# Altium project PROC101D_SCH_With_Design_Updates..Notes_V1.0.PrjPcb (part 9 of 23)

## Sheet 22.SchDoc
size 513 x 386 mm
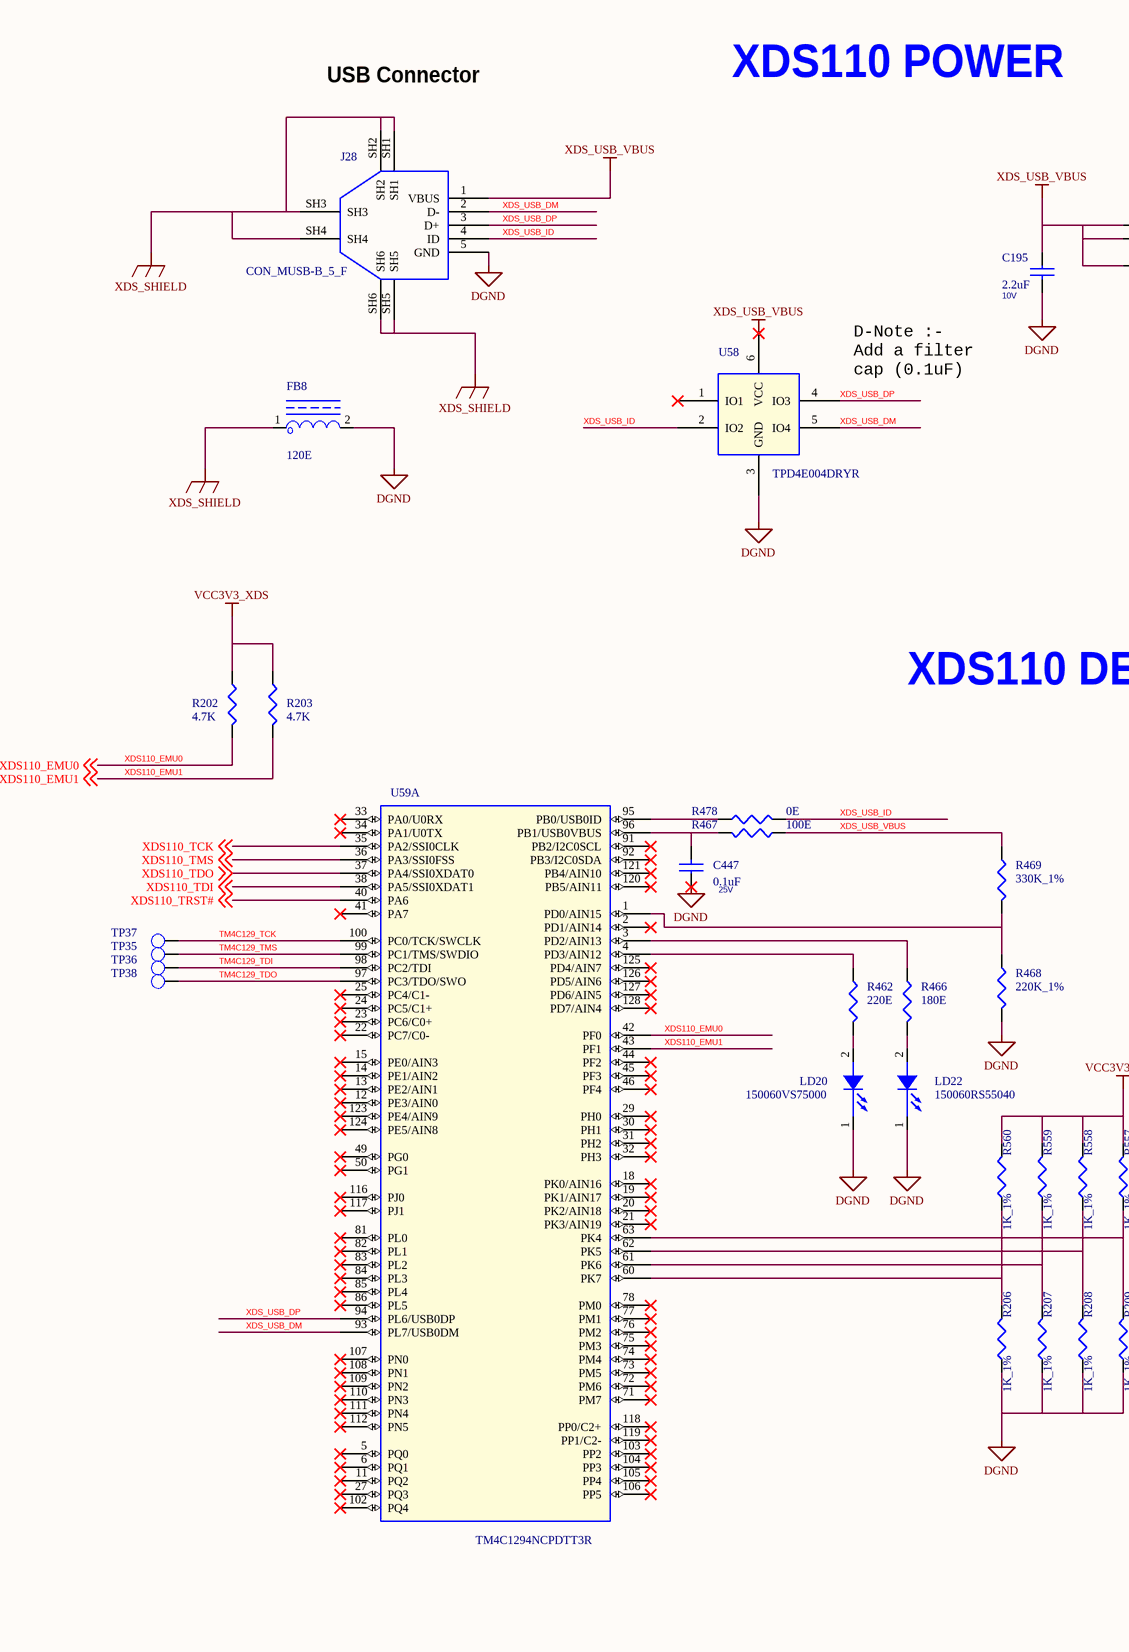
[diagram p34: 22.SchDoc, left]
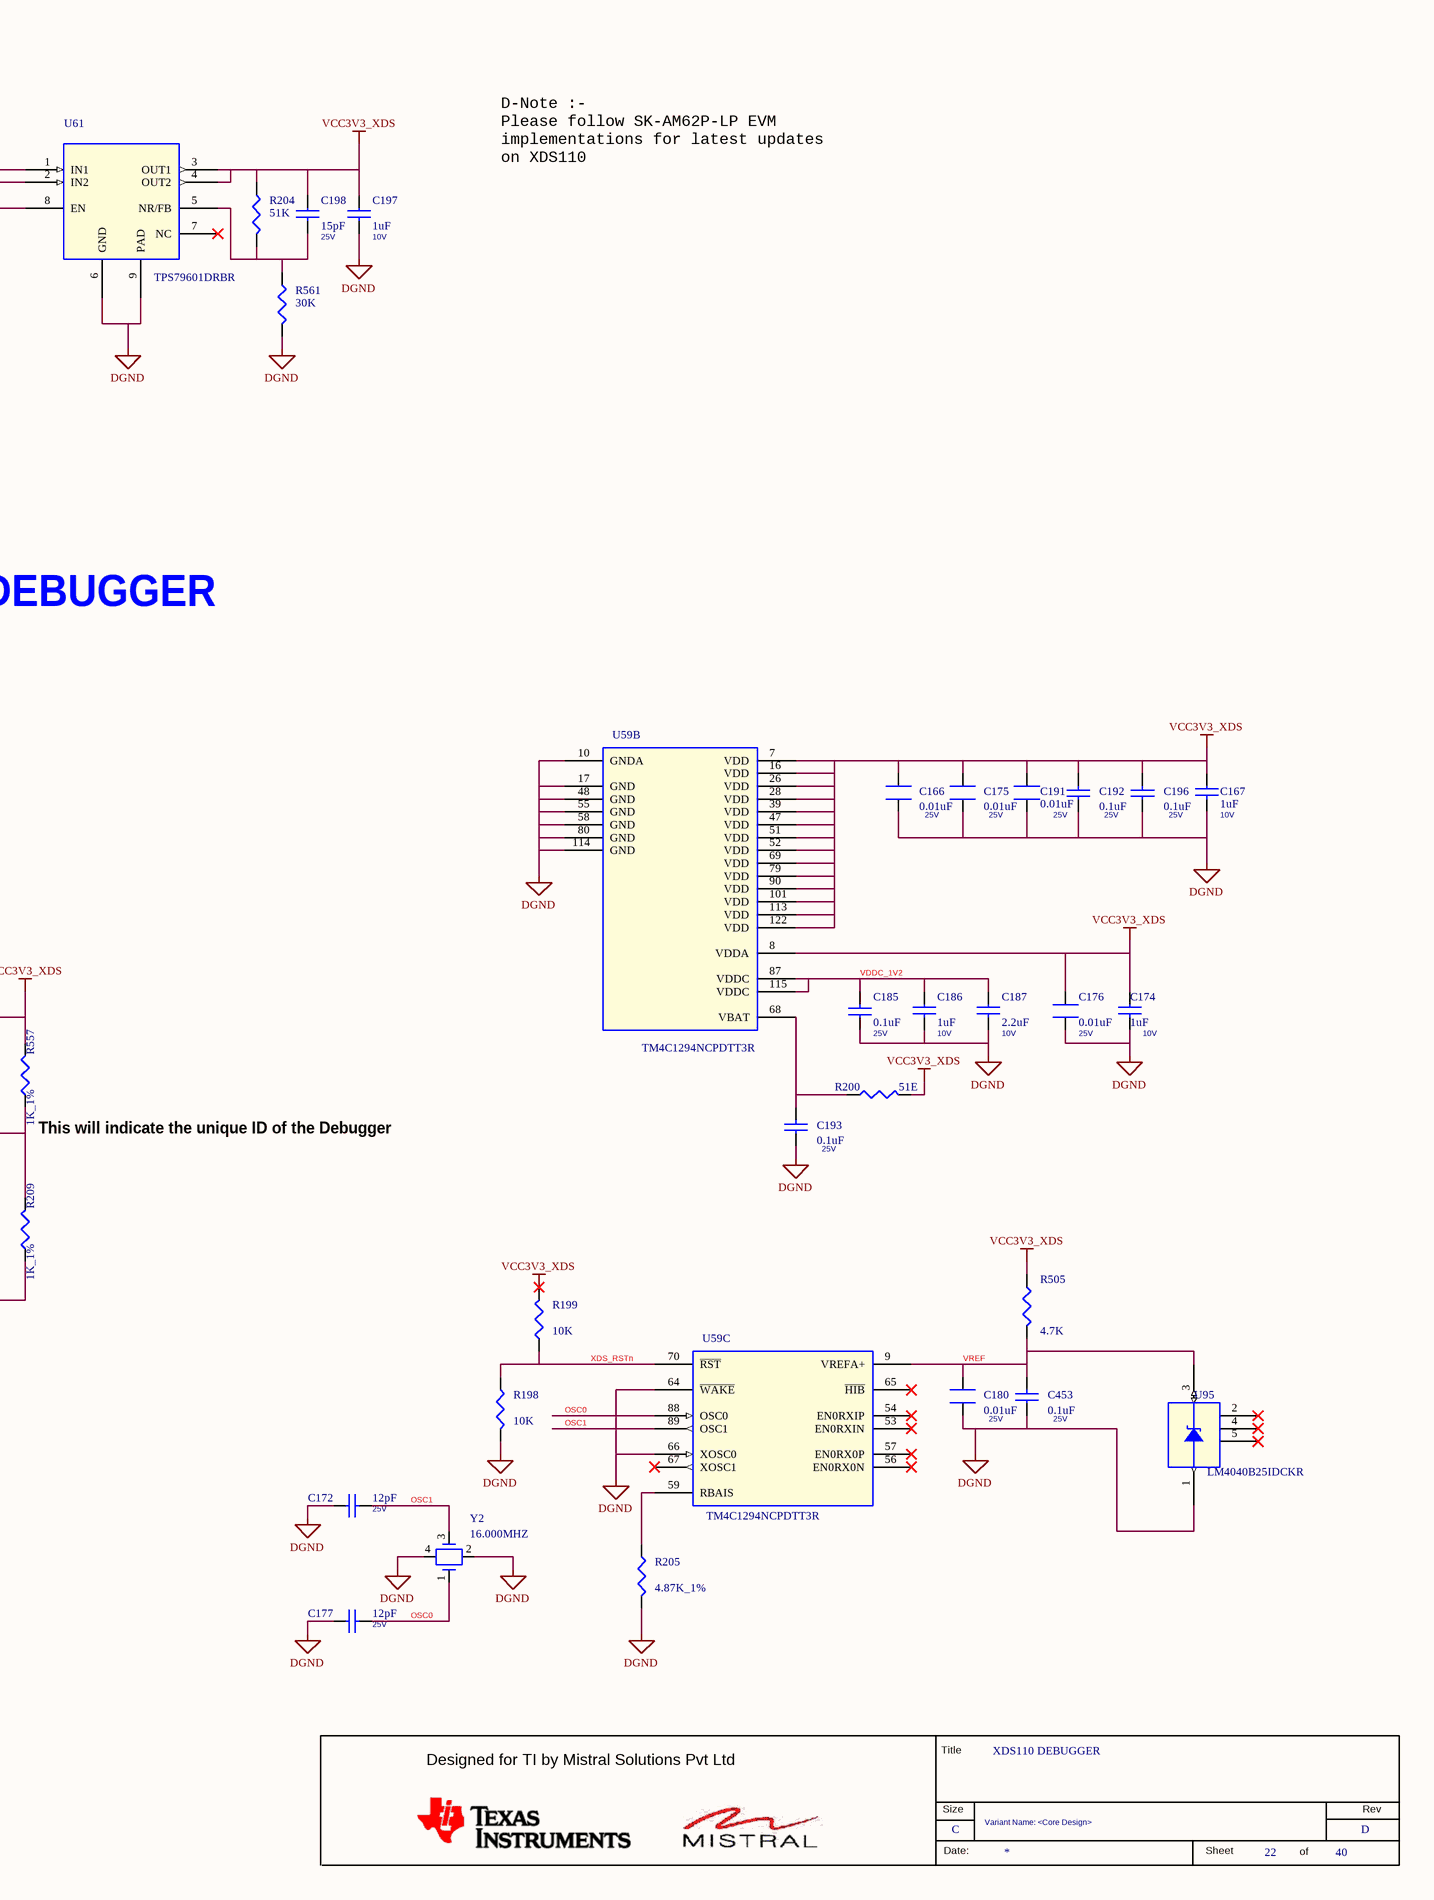
[diagram p35: 22.SchDoc, right]

### Parts
(Parts that share a designator on the sheet are numbered #1, #2 ... from top to bottom, then left to right.)
*#22  RevCode: D  Title: XDS110 DEBUGGER  Page Size: C  Page Number: 22  Page Count: 40  Variant Name: <Core Design>  (hidden comment: MISTRAL_TITLEBLK_CSIZE)  (graphical)
C166  0.01uF  Voltage: 25V  [CAP0402N]
C167  1uF  Voltage: 10V  [CAP0402_0-75]
C172  12pF  Voltage: 25V  [CAP0201_0-5]
C174  1uF  Voltage: 10V  [CAP0402_0-75]
C175  0.01uF  Voltage: 25V  [CAP0402N]
C176  0.01uF  Voltage: 25V  [CAP0402N]
C177  12pF  Voltage: 25V  [CAP0201_0-5]
C180  0.01uF  Voltage: 25V  [CAP0402N]
C185  0.1uF  Voltage: 25V  [CAP0402_0-75]
C186  1uF  Voltage: 10V  [CAP0402_0-75]
C187  2.2uF  Voltage: 10V  [CAP0402_0-75]
C191  0.01uF  Voltage: 25V  [CAP0402N]
C192  0.1uF  Voltage: 25V  [CAP0402_0-75]
C193  0.1uF  Voltage: 25V  [CAP0402_0-75]
C195  2.2uF  Voltage: 10V  [CAP0402_0-75]
C196  0.1uF  Voltage: 25V  [CAP0402_0-75]
C197  1uF  Voltage: 10V  [CAP0402_0-75]
C198  15pF  Voltage: 25V  [CAP0402_0-75]
C447  0.1uF  Voltage: 25V  [CAP0402_0-75]
C453  0.1uF  Voltage: 25V  [CAP0402_0-75]
FB8  120E  [IND0603_1]
J28  CON_MUSB-B_5_F  [CON_MUSBB5_1051640001_S_R_S_2-5]
LD20  150060VS75000  [LED_150060SS75000_70X40_SMD_0-8]
LD22  150060RS55040  [LED_150060RS55040_70X40_SMD_0-5]
R198  10K  [RES0402_0-5]
R199  10K  [RES0402_0-5]
R200  51E  [RES0402_0-5]
R202  4.7K  [RES0402_0-5]
R203  4.7K  [RES0402_0-5]
R204  51K  [RES0402_0-5]
R205  4.87K_1%  [RES0402_0-5]
R206  1K_1%  [RES0402_0-5]
R207  1K_1%  [RES0402_0-5]
R208  1K_1%  [RES0402_0-5]
R209  1K_1%  [RES0402_0-5]
R462  220E  [RES0402_0-5]
R466  180E  [RES0402_0-5]
R467  100E  [RES0402_0-5]
R468  220K_1%  [RES0402_0-5]
R469  330K_1%  [RES0402_0-5]
R478  0E  [RES0402_0-5]
R505  4.7K  [RES0402_0-5]
R557  1K_1%  [RES0402_0-5]
R558  1K_1%  [RES0402_0-5]
R559  1K_1%  [RES0402_0-5]
R560  1K_1%  [RES0402_0-5]
R561  30K  [RES0402_0-5]
TP35  TP20_SMD  [TP20_SMD]  (value not drawn)
TP36  TP20_SMD  [TP20_SMD]  (value not drawn)
TP37  TP20_SMD  [TP20_SMD]  (value not drawn)
TP38  TP20_SMD  [TP20_SMD]  (value not drawn)
U58  TPD4E004DRYR  [SON6_19-68_40X60_PB_0-6]
U59  TM4C1294NCPDTT3R  [TQFP128_15-74_550X550_1-2]  (parts A,B,C of 3)
U61  TPS79601DRBR  [SON8_25-59_130X130_1]
U95  LM4040B25IDCKR  [SC70-5_1-1]
Y2  16.000MHZ  [XTAL4_NX3225GA_130X100_SMD_0-9]

### Nets
DGND: C166.2 C167.2 C172.1 C174.2 C175.2 C176.2 C177.1 C180.2 C185.1 C186.2 C187.2 C191.2 C192.1 C193.1 C195.2 C196.1 C197.2 C447.1 C453.1 FB8.2 J28.5(GND) LD20.1(CATHODE) LD22.1(CATHODE) R198.2 R205.2 R206.1 R207.1 R208.1 R209.1 R468.2 R561.2 U58.3(GND) U59.10(GNDA) U59.17(GND) U59.48(GND) U59.55(GND) U59.58(GND) U59.64(~{WAKE}) U59.66(XOSC0) U59.80(GND) U59.114(GND) U61.6(GND) U61.9(PAD) U95.1(ANODE) Y2.2 Y2.4
VCC3V3_XDS: C166.1 C167.1 C174.1 C175.1 C176.1 C191.1 C192.2 C196.2 C197.1 C198.1 R199.2 R200.2 R202.1 R203.1 R204.1 R505.1 R557.2 R558.2 R559.2 R560.2 U59.7(VDD) U59.8(VDDA) U59.16(VDD) U59.26(VDD) U59.28(VDD) U59.39(VDD) U59.47(VDD) U59.51(VDD) U59.52(VDD) U59.69(VDD) U59.79(VDD) U59.90(VDD) U59.101(VDD) U59.113(VDD) U59.122(VDD) U61.3(OUT1) U61.4(OUT2)
XDS_SHIELD: FB8.1 J28.SH1 J28.SH2 J28.SH3 J28.SH4 J28.SH5 J28.SH6
XDS_USB_VBUS: C195.1 J28.1(VBUS) R467.1 R469.1 U58.6(VCC) U61.1(IN1) U61.2(IN2) U61.8(EN)
OSC0: C177.2 U59.88(OSC0) Y2.1
OSC1: C172.2 U59.89(OSC1) Y2.3
TM4C129_TCK: TP37.1(TP) U59.100(PC0/TCK/SWCLK)
TM4C129_TDI: TP36.1(TP) U59.98(PC2/TDI)
TM4C129_TDO: TP38.1(TP) U59.97(PC3/TDO/SWO)
TM4C129_TMS: TP35.1(TP) U59.99(PC1/TMS/SWDIO)
VDDC_1V2: C185.2 C186.1 C187.1 U59.87(VDDC) U59.115(VDDC)
VREF: C180.1 C453.2 R505.2 U59.9(VREFA+) U95.3(CATHODE)
XDS110_EMU0: R202.2 U59.42(PF0) ; off-sheet XDS110_EMU0
XDS110_EMU1: R203.2 U59.43(PF1) ; off-sheet XDS110_EMU1
XDS110_TCK: U59.35(PA2/SSI0CLK) ; off-sheet XDS110_TCK
XDS110_TDI: U59.38(PA5/SSI0XDAT1) ; off-sheet XDS110_TDI
XDS110_TDO: U59.37(PA4/SSI0XDAT0) ; off-sheet XDS110_TDO
XDS110_TMS: U59.36(PA3/SSI0FSS) ; off-sheet XDS110_TMS
XDS110_TRST#: U59.40(PA6) ; off-sheet XDS110_TRST#
XDS_RSTn: R198.1 R199.1 U59.70(~{RST})
XDS_USB_DM: J28.2(D-) U58.5(IO4) U59.93(PL7/USB0DM)
XDS_USB_DP: J28.3(D+) U58.4(IO3) U59.94(PL6/USB0DP)
XDS_USB_ID: J28.4(ID) R478.2 U58.2(IO2)
NetC193_2: C193.2 R200.1 U59.68(VBAT)
NetC198_2: C198.2 R204.2 R561.1 U61.5(NR/FB)
NetC447_2: C447.2 R467.2 U59.96(PB1/USB0VBUS)
NetLD20_2: LD20.2(ANODE) R462.2
NetLD22_2: LD22.2(ANODE) R466.2
NetR205_1: R205.1 U59.59(RBAIS)
NetR206_2: R206.2 R560.1 U59.60(PK7)
NetR207_2: R207.2 R559.1 U59.61(PK6)
NetR208_2: R208.2 R558.1 U59.62(PK5)
NetR209_2: R209.2 R557.1 U59.63(PK4)
NetR462_1: R462.1 U59.4(PD3/AIN12)
NetR466_1: R466.1 U59.3(PD2/AIN13)
NetR468_1: R468.1 R469.2 U59.1(PD0/AIN15)
NetR478_1: R478.1 U59.95(PB0/USB0ID)

Not connected (* = marked no-connect by the designer): U58 1(IO1)*; U59 2(PD1/AIN14)* 5(PQ0)* 6(PQ1)* 11(PQ2)* 12(PE3/AIN0)* 13(PE2/AIN1)* 14(PE1/AIN2)* 15(PE0/AIN3)* 18(PK0/AIN16)* 19(PK1/AIN17)* 20(PK2/AIN18)* 21(PK3/AIN19)* 22(PC7/C0-)* 23(PC6/C0+)* 24(PC5/C1+)* 25(PC4/C1-)* 27(PQ3)* 29(PH0)* 30(PH1)* 31(PH2)* 32(PH3)* 33(PA0/U0RX)* 34(PA1/U0TX)* 41(PA7)* 44(PF2)* 45(PF3)* 46(PF4)* 49(PG0)* 50(PG1)* 53(EN0RXIN)* 54(EN0RXIP)* 56(EN0RX0N)* 57(EN0RX0P)* 65(~{HIB})* 67(XOSC1)* 71(PM7)* 72(PM6)* 73(PM5)* 74(PM4)* 75(PM3)* 76(PM2)* 77(PM1)* 78(PM0)* 81(PL0)* 82(PL1)* 83(PL2)* 84(PL3)* 85(PL4)* 86(PL5)* 91(PB2/I2C0SCL)* 92(PB3/I2C0SDA)* 102(PQ4)* 103(PP2)* 104(PP3)* 105(PP4)* 106(PP5)* 107(PN0)* 108(PN1)* 109(PN2)* 110(PN3)* 111(PN4)* 112(PN5)* 116(PJ0)* 117(PJ1)* 118(PP0/C2+)* 119(PP1/C2-)* 120(PB5/AIN11)* 121(PB4/AIN10)* 123(PE4/AIN9)* 124(PE5/AIN8)* 125(PD4/AIN7)* 126(PD5/AIN6)* 127(PD6/AIN5)* 128(PD7/AIN4)*; U61 7(NC)*; U95 2(NC1)* 4(NC2)* 5(NC3)*

### Notes on the sheet
- USB Connector
- XDS110 POWER
- D-Note :-
  Please follow SK-AM62P-LP EVM
  implementations for latest updates
  on XDS110
- D-Note :-
  Add a filter
  cap (0.1uF)
- XDS110 DEBUGGER
- (near R557) This will indicate the unique ID of the Debugger
- (in symbol MISTRAL_TITLEBLK_CSIZE) Title; Designed for TI by Mistral Solutions Pvt Ltd; Size; Rev; Date:; Sheet; of

### Library data of the parts
*#22 = MISTRAL_TITLEBLK_CSIZE: Issue: 1.0; Page Create Date: March  8, 1995; Page Modify Date: *
C166 C175 C180 C191 = CAP_Dup2: CAP CERAMIC 0.01uF 25V 10% X7R 0402; Mistral Part No: 120011090040-R; Mfr_name: WURTH ELECTRONICS; Mfr_part_number: 885012205050; Part_type: CAPACITORS\CERAMIC; PCB Footprint: CAP0402_0-75; Project: AM64x_EVM_BRD; Customs_HS_Code: 85322990; Custom_Duty: 15%; Wattage: NA; Library Ref: CAP; Tolerance: 10%; Package: 0402; Distributor_name: DIGIKEY; Distributor_part_number: 732-7545-1-ND; Height: 0.55MM; Datasheet: Y:\MIS_DATABASE\DATASHEETS\CAPACITORS\885012205050.PDF; Crtd /date: ALVY/170820; Chkd/date: MANIRAJA/170820; Weight: 0.65mg; Temperature: -55癈+125癈; MECHANICAL 3D STEP FILE: CAP0402_0-75; Footprint Ref: CAP0402_0-75; Library Path: Y:\MIS_DATABASE\Library\ALTIUM_TOOL\SCHEMATICS_PARTS\MS_DISCRETE_Library.schlib; Footprint Path: Y:\MIS_DATABASE\Library\ALTIUM_TOOL\PCB_FOOTPRINTS\Altium_Footprint_Lib.PcbLib
C167 C174 = CAP_Dup3: CAP CERAMIC 1uF 10V 20% X5R 0402; Part_type: CAPACITORS\CERAMIC; Mfr_part_number: 885012105012; Mfr_name: WURTH ELECTRONICS; Mistral Part No: 120020080009-R; Wattage: NA; Custom_Duty: 15%; Customs_HS_Code: 85322990; Project: AM64x_EVM_BRD; PCB Footprint: CAP0402_0-75; Footprint Ref: CAP0402_0-75; Library Ref: CAP; Footprint Path: Y:\MIS_DATABASE\Library\ALTIUM_TOOL\PCB_FOOTPRINTS\Altium_Footprint_Lib.PcbLib; Library Path: Y:\MIS_DATABASE\Library\ALTIUM_TOOL\SCHEMATICS_PARTS\MS_DISCRETE_Library.schlib; MECHANICAL 3D STEP FILE: CAP0402_0-75; Chkd/date: MANIRAJA/210820; Crtd /date: ALVY/190820; Datasheet: Y:\MIS_DATABASE\DATASHEETS\CAPACITORS\885012105012.PDF; Temperature: -55癈+85癈; Weight: 0.65mg; Height: 0.55MM; Distributor_part_number: 732-7489-1-ND; Distributor_name: DIGIKEY; Package: 0402; Tolerance: 20%
C172 = CAP_Dup3: CAP CERAMIC 12pF 25V 5% C0G(NP0) 0201; Part_type: CAPACITORS\CERAMIC; Mfr_part_number: GRM0335C1E120JA01D; Mfr_name: MURATA; Mistral Part No: 120009030213-R; Custom_Duty: 15%; Customs_HS_Code: 85322990; Wattage: NA; Project: QCS610_NANOSOM; PCB Footprint: CAP0201_0-5; Footprint Path: Y:\MIS_DATABASE\Library\ALTIUM_TOOL\PCB_FOOTPRINTS\Altium_Footprint_Lib.PcbLib; Library Path: Y:\MIS_DATABASE\Library\ALTIUM_TOOL\SCHEMATICS_PARTS\MS_DISCRETE_Library.schlib; MECHANICAL 3D STEP FILE: CAP0201_0-5; Chkd/date: MANIRAJA/020620; Crtd /date: ALVY/300520; Datasheet: Y:\MIS_DATABASE\DATASHEETS\CAPACITORS\GRM0335C1E120JA01.PDF; Temperature: -55癈+125癈; Weight: 0.33mg; Height: 0.33MM; Library Ref: CAP; Distributor_part_number: 490-3144-1-ND; Distributor_name: DIGIKEY; Package: 0201; Tolerance: 5%; Footprint Ref: CAP0201_0-5
C176 = CAP_Dup2: CAP CERAMIC 0.01uF 25V 10% X7R 0402; Part_type: CAPACITORS\CERAMIC; Mfr_part_number: 885012205050; Mfr_name: WURTH ELECTRONICS; Mistral Part No: 120011090040-R; PCB Footprint: CAP0402_0-75; Wattage: NA; Custom_Duty: 15%; Customs_HS_Code: 85322990; Project: AM64x_EVM_BRD; Footprint Path: Y:\MIS_DATABASE\Library\ALTIUM_TOOL\PCB_FOOTPRINTS\Altium_Footprint_Lib.PcbLib; Library Path: Y:\MIS_DATABASE\Library\ALTIUM_TOOL\SCHEMATICS_PARTS\MS_DISCRETE_Library.schlib; Footprint Ref: CAP0402_0-75; MECHANICAL 3D STEP FILE: CAP0402_0-75; Temperature: -55癈+125癈; Weight: 0.65mg; Chkd/date: MANIRAJA/170820; Crtd /date: ALVY/170820; Datasheet: Y:\MIS_DATABASE\DATASHEETS\CAPACITORS\885012205050.PDF; Height: 0.55MM; Distributor_part_number: 732-7545-1-ND; Distributor_name: DIGIKEY; Package: 0402; Tolerance: 10%; Library Ref: CAP
C177 = CAP_Dup3: CAP CERAMIC 12pF 25V 5% C0G(NP0) 0201; Mistral Part No: 120009030213-R; Mfr_name: MURATA; Mfr_part_number: GRM0335C1E120JA01D; Part_type: CAPACITORS\CERAMIC; Project: QCS610_NANOSOM; Wattage: NA; Customs_HS_Code: 85322990; Custom_Duty: 15%; PCB Footprint: CAP0201_0-5; Footprint Ref: CAP0201_0-5; Tolerance: 5%; Package: 0201; Distributor_name: DIGIKEY; Distributor_part_number: 490-3144-1-ND; Library Ref: CAP; Height: 0.33MM; Weight: 0.33mg; Temperature: -55癈+125癈; Datasheet: Y:\MIS_DATABASE\DATASHEETS\CAPACITORS\GRM0335C1E120JA01.PDF; Crtd /date: ALVY/300520; Chkd/date: MANIRAJA/020620; MECHANICAL 3D STEP FILE: CAP0201_0-5; Library Path: Y:\MIS_DATABASE\Library\ALTIUM_TOOL\SCHEMATICS_PARTS\MS_DISCRETE_Library.schlib; Footprint Path: Y:\MIS_DATABASE\Library\ALTIUM_TOOL\PCB_FOOTPRINTS\Altium_Footprint_Lib.PcbLib
C185 C196 = CAP_Dup3: CAP CERAMIC 0.1uF 25V 20% X5R 0402; Alt_Mfr_part_number: CC0402KRX5R8BB104; Mistral Part No: 120020080003-R; Mfr_name: WURTH ELECTRONICS; Mfr_part_number: 885012105018; Part_type: CAPACITORS\CERAMIC; Alt_Mfr_name: YAGEO AMERICA; Project: AM64x_EVM_BRD; Wattage: NA; Customs_HS_Code: 85322990; Custom_Duty: 15%; PCB Footprint: CAP0402_0-75; Tolerance: 20%; Package: 0402; Distributor_name: DIGIKEY; Distributor_part_number: 732-7495-1-ND; Height: 0.55MM; Weight: 0.65mg; Temperature: -55癈+85癈; Datasheet: Y:\MIS_DATABASE\DATASHEETS\CAPACITORS\885012105018.PDF; Crtd /date: ALVY/170820; Chkd/date: MANIRAJA/170820; MECHANICAL 3D STEP FILE: CAP0402_0-75; Library Ref: CAP; Footprint Ref: CAP0402_0-75; Library Path: Y:\MIS_DATABASE\Library\ALTIUM_TOOL\SCHEMATICS_PARTS\MS_DISCRETE_Library.schlib; Footprint Path: Y:\MIS_DATABASE\Library\ALTIUM_TOOL\PCB_FOOTPRINTS\Altium_Footprint_Lib.PcbLib
C186 C197 = CAP_Dup3: CAP CERAMIC 1uF 10V 20% X5R 0402; Mistral Part No: 120020080009-R; Mfr_name: WURTH ELECTRONICS; Mfr_part_number: 885012105012; Part_type: CAPACITORS\CERAMIC; Wattage: NA; Project: AM64x_EVM_BRD; Customs_HS_Code: 85322990; Custom_Duty: 15%; PCB Footprint: CAP0402_0-75; Footprint Ref: CAP0402_0-75; Library Ref: CAP; Footprint Path: Y:\MIS_DATABASE\Library\ALTIUM_TOOL\PCB_FOOTPRINTS\Altium_Footprint_Lib.PcbLib; Library Path: Y:\MIS_DATABASE\Library\ALTIUM_TOOL\SCHEMATICS_PARTS\MS_DISCRETE_Library.schlib; MECHANICAL 3D STEP FILE: CAP0402_0-75; Tolerance: 20%; Package: 0402; Distributor_name: DIGIKEY; Distributor_part_number: 732-7489-1-ND; Height: 0.55MM; Weight: 0.65mg; Temperature: -55癈+85癈; Datasheet: Y:\MIS_DATABASE\DATASHEETS\CAPACITORS\885012105012.PDF; Crtd /date: ALVY/190820; Chkd/date: MANIRAJA/210820
C187 C195 = CAP_Dup3: CAP CERAMIC 2.2uF 10V 20% X5R 0402; Part_type: CAPACITORS\CERAMIC; Mfr_part_number: 885012105013; Mfr_name: WURTH ELECTRONICS; Mistral Part No: 120019040036-R; Custom_Duty: 15%; Customs_HS_Code: 85322990; Wattage: NA; Project: AM64x_EVM_BRD; PCB Footprint: CAP0402_0-75; Library Ref: CAP; MECHANICAL 3D STEP FILE: CAP0402_0-75; Chkd/date: MANIRAJA/170820; Crtd /date: ALVY/170820; Datasheet: Y:\MIS_DATABASE\DATASHEETS\CAPACITORS\885012105013.PDF; Temperature: -55癈+85癈; Weight: 0.65mg; Height: 0.55MM; Distributor_part_number: 732-7490-1-ND; Distributor_name: DIGIKEY; Package: 0402; Tolerance: 20%; Footprint Ref: CAP0402_0-75; Library Path: Y:\MIS_DATABASE\Library\ALTIUM_TOOL\SCHEMATICS_PARTS\MS_DISCRETE_Library.schlib; Footprint Path: Y:\MIS_DATABASE\Library\ALTIUM_TOOL\PCB_FOOTPRINTS\Altium_Footprint_Lib.PcbLib
C192 C193 C447 C453 = CAP_Dup3: CAP CERAMIC 0.1uF 25V 20% X5R 0402; Alt_Mfr_name: YAGEO AMERICA; Part_type: CAPACITORS\CERAMIC; Mfr_part_number: 885012105018; Mfr_name: WURTH ELECTRONICS; Mistral Part No: 120020080003-R; Alt_Mfr_part_number: CC0402KRX5R8BB104; Custom_Duty: 15%; Customs_HS_Code: 85322990; Wattage: NA; Project: AM64x_EVM_BRD; PCB Footprint: CAP0402_0-75; Footprint Path: Y:\MIS_DATABASE\Library\ALTIUM_TOOL\PCB_FOOTPRINTS\Altium_Footprint_Lib.PcbLib; Library Path: Y:\MIS_DATABASE\Library\ALTIUM_TOOL\SCHEMATICS_PARTS\MS_DISCRETE_Library.schlib; Footprint Ref: CAP0402_0-75; Library Ref: CAP; MECHANICAL 3D STEP FILE: CAP0402_0-75; Chkd/date: MANIRAJA/170820; Crtd /date: ALVY/170820; Datasheet: Y:\MIS_DATABASE\DATASHEETS\CAPACITORS\885012105018.PDF; Temperature: -55癈+85癈; Weight: 0.65mg; Height: 0.55MM; Distributor_part_number: 732-7495-1-ND; Distributor_name: DIGIKEY; Package: 0402; Tolerance: 20%
C198 = CAP_Dup3: CAP CERAMIC 15pF 25V 5% C0G(NP0) 0402; Part_type: CAPACITORS\CERAMIC; Mfr_part_number: 885012005041; Mfr_name: WURTH ELECTRONICS; Mistral Part No: 120020020004-R; Custom_Duty: 15%; Customs_HS_Code: 85322990; Wattage: NA; Project: AM64x_EVM_BRD; PCB Footprint: CAP0402_0-75; Library Ref: CAP; MECHANICAL 3D STEP FILE: CAP0402_0-75; Chkd/date: MANIRAJA/170820; Crtd /date: ALVY/170820; Datasheet: Y:\MIS_DATABASE\DATASHEETS\CAPACITORS\885012005041.PDF; Temperature: -55癈+125癈; Weight: 0.65mg; Height: 0.55MM; Distributor_part_number: 732-7456-1-ND; Distributor_name: DIGIKEY; Package: 0402; Tolerance: 5%; Footprint Ref: CAP0402_0-75; Library Path: Y:\MIS_DATABASE\Library\ALTIUM_TOOL\SCHEMATICS_PARTS\MS_DISCRETE_Library.schlib; Footprint Path: Y:\MIS_DATABASE\Library\ALTIUM_TOOL\PCB_FOOTPRINTS\Altium_Footprint_Lib.PcbLib
FB8 = INDUCTOR_FERRITE: IND FERRITE BEAD CHIP 120E 2A 0603; Mfr_part_number: 782631141; Mfr_name: WURTH ELECTRONICS; Mistral Part No: 130020080015-R; Custom_Duty: 24%; Customs_HS_Code: 85437099; Wattage: NA; Tolerance: 25%; Project: AM64x_EVM_BRD; Footprint Path: Y:\MIS_DATABASE\Library\ALTIUM_TOOL\PCB_FOOTPRINTS\Altium_Footprint_Lib.PcbLib; Library Path: Y:\MIS_DATABASE\Library\ALTIUM_TOOL\SCHEMATICS_PARTS\MS_FILTER_Library.schlib; MECHANICAL 3D STEP FILE: IND0603_1; Chkd/date: MANIRAJA/180820; Crtd /date: ALVY/180820; Datasheet: Y:\MIS_DATABASE\DATASHEETS\DISCRETES\INDUCTORS\782631141.PDF; Temperature: -55癈+125癈; Weight: NA; Height: 1.00MM; Library Ref: INDUCTOR_FERRITE; Distributor_part_number: 732-782631141CT-ND; Distributor_name: DIGIKEY; Package: 0603; Voltage: NA; Part_type: INDUCTOR; Footprint Ref: IND0603_1; PCB Footprint: IND0603_1
J28 = CON_MUSB-B_5_1051640001: CON MICRO USB-B TYPE 5POS FEMALE RT SMD; Part_type: CONNECTOR\USB; Mfr_name: MOLEX; Mistral Part No: 150017080018-R; Custom_Duty: 24%; Customs_HS_Code: 85369090; Wattage: NA; Project: TI_MAXIE_CPB; Library Ref: CON_MUSB-B_5_1051640001; MECHANICAL 3D STEP FILE: CON_MUSBB5_1051640001_S_R_S_2-5; Chkd/date: MANIRAJA/230817; Crtd /date: MANIRAJA/230817; Datasheet: Y:\MIS_DATABASE\DATASHEETS\CONNECTORS\1051640001.PDF; Temperature: -35癈+85癈; Weight: 234mg; Height: 2.45MM; Distributor_part_number: WM11263CT-ND; Distributor_name: DIGIKEY; Package: SMD; Voltage: NA; Tolerance: NA; Mfr_part_number: 1051640001; PCB Footprint: CON_MUSBB5_1051640001_S_R_S_2-5
LD20 = DIODE_LED: DIODE LED BRIGHT GREEN SMD; Part_type: OPTO\LED; Mfr_name: WURTH ELECTRONICS; Mistral Part No: 130020070019-R; Custom_Duty: 24%; Customs_HS_Code: 85439000; Wattage: NA; Project: AM64x-IO LINK BRD; Footprint Path: Y:\MIS_DATABASE\Library\ALTIUM_TOOL\PCB_FOOTPRINTS\Altium_Footprint_Lib.PcbLib; Library Path: Y:\MIS_DATABASE\Library\ALTIUM_TOOL\SCHEMATICS_PARTS\MS_OPTO_Library.schlib; MECHANICAL 3D STEP FILE: LED_150060SS75000_70X40_SMD_0-8; Footprint Ref: LED_150060SS75000_70X40_SMD_0-8; Library Ref: DIODE_LED; Chkd/date: MANIRAJA/220720; Crtd /date: ALVY/210720; Datasheet: Y:\MIS_DATABASE\DATASHEETS\DISCRETES\LEDS\150060VS75000.PDF; Temperature: -40癈+85癈; Weight: 25mg; Height: 0.80MM; Distributor_part_number: 732-4980-1-ND; Distributor_name: DIGIKEY; Package: SMD; Voltage: NA; Tolerance: NA; Mfr_part_number: 150060VS75000; PCB Footprint: LED_150060SS75000_70X40_SMD_0-8
LD22 = DIODE_LED: DIODE LED RED SMD; Mistral Part No: 130020080014-R; Mfr_name: WURTH ELECTRONICS; Part_type: OPTO\LED; Project: AM64x_EVM_BRD; Tolerance: NA; Customs_HS_Code: 85439000; Custom_Duty: 24%; Footprint Ref: LED_150060RS55040_70X40_SMD_0-5; Library Ref: DIODE_LED; Footprint Path: Y:\MIS_DATABASE\Library\ALTIUM_TOOL\PCB_FOOTPRINTS\Altium_Footprint_Lib.PcbLib; Library Path: Y:\MIS_DATABASE\Library\ALTIUM_TOOL\SCHEMATICS_PARTS\MS_OPTO_Library.schlib; Mfr_part_number: 150060RS55040; Voltage: NA; Wattage: NA; Package: SMD; Distributor_name: DIGIKEY; Distributor_part_number: 732-12015-1-ND; Height: 0.50MM; Weight: 29mg; Temperature: -40癈+85癈; Datasheet: Y:\MIS_DATABASE\DATASHEETS\DISCRETES\LEDS\150060RS55040.PDF; Crtd /date: ALVY/180820; Chkd/date: MANIRAJA/180820; MECHANICAL 3D STEP FILE: LED_150060RS55040_70X40_SMD_0-5; PCB Footprint: LED_150060RS55040_70X40_SMD_0-5
R198 = RESISTOR_Dup6: RES 10K 1/16W 5% 0402; Mistral Part No: 110011060021-R; Mfr_name: YAGEO AMERICA; Mfr_part_number: RC0402JR-0710KL; Part_type: RESISTORS\FIXED; Project: HSE; Voltage: NA; Customs_HS_Code: 85332119; Custom_Duty: 15%; PCB Footprint: RES0402_0-5; Tolerance: 5%; Wattage: 1/16W; Package: 0402; Distributor_name: DIGIKEY; Distributor_part_number: 311-10KJRCT-ND; Height: 0.40MM; Weight: 0.65mg; Temperature: -55癈+155癈; Datasheet: Y:\MIS_DATABASE\DATASHEETS\RESISTORS\RCXXXXL-SER_MAR18.PDF; Crtd /date: MAZHAR/230805; Chkd/date: VASANTHA/061216; MECHANICAL 3D STEP FILE: RES0402_0-5; Library Ref: RESISTOR; Footprint Ref: RES0402_0-5; Library Path: Y:\MIS_DATABASE\Library\ALTIUM_TOOL\SCHEMATICS_PARTS\MS_DISCRETE_Library.schlib; Footprint Path: Y:\MIS_DATABASE\Library\ALTIUM_TOOL\PCB_FOOTPRINTS\Altium_Footprint_Lib.PcbLib
R199 = RESISTOR_Dup6: RES 10K 1/16W 5% 0402; Part_type: RESISTORS\FIXED; Mfr_part_number: RC0402JR-0710KL; Mfr_name: YAGEO AMERICA; Mistral Part No: 110011060021-R; Custom_Duty: 15%; Customs_HS_Code: 85332119; Voltage: NA; Project: HSE; PCB Footprint: RES0402_0-5; MECHANICAL 3D STEP FILE: RES0402_0-5; Chkd/date: VASANTHA/061216; Crtd /date: MAZHAR/230805; Datasheet: Y:\MIS_DATABASE\DATASHEETS\RESISTORS\RCXXXXL-SER_MAR18.PDF; Temperature: -55癈+155癈; Weight: 0.65mg; Height: 0.40MM; Distributor_part_number: 311-10KJRCT-ND; Distributor_name: DIGIKEY; Package: 0402; Wattage: 1/16W; Tolerance: 5%; Library Ref: RESISTOR; Footprint Ref: RES0402_0-5; Library Path: Y:\MIS_DATABASE\Library\ALTIUM_TOOL\SCHEMATICS_PARTS\MS_DISCRETE_Library.schlib; Footprint Path: Y:\MIS_DATABASE\Library\ALTIUM_TOOL\PCB_FOOTPRINTS\Altium_Footprint_Lib.PcbLib
R200 = RESISTOR_Dup6: RES 51E 1/10W 5% 0402; Part_type: RESISTORS\FIXED; Mfr_part_number: ERJ-2GEJ510X; Mfr_name: PANASONIC-ECG; Mistral Part No: 110009030962-R; Voltage: NA; Custom_Duty: 15%; Customs_HS_Code: 85332119; Project: CTP02_REVA_BASE; PCB Footprint: RES0402_0-5; Footprint Path: Y:\MIS_DATABASE\Library\ALTIUM_TOOL\PCB_FOOTPRINTS\Altium_Footprint_Lib.PcbLib; Library Path: Y:\MIS_DATABASE\Library\ALTIUM_TOOL\SCHEMATICS_PARTS\MS_DISCRETE_Library.schlib; MECHANICAL 3D STEP FILE: RES0402_0-5; Temperature: -55癈+155癈; Weight: 0.8mg; Footprint Ref: RES0402_0-5; Chkd/date: VASANTHA/291216; Crtd /date: MAZHAR/120505; Datasheet: Y:\MIS_DATABASE\DATASHEETS\RESISTORS\PAN-ERJSER_NOV17.PDF; Height: 0.40MM; Distributor_part_number: P51JCT-ND; Distributor_name: DIGIKEY; Package: 0402; Wattage: 1/10W; Tolerance: 5%; Library Ref: RESISTOR
R202 R505 = RESISTOR_Dup4: RES 4.7K 1/16W 5% 0402; Mistral Part No: 110011060001-R; Mfr_name: YAGEO AMERICA; Mfr_part_number: RC0402JR-074K7L; Part_type: RESISTORS\FIXED; Project: TMDXCSK368; Voltage: NA; Customs_HS_Code: 85332119; Custom_Duty: 15%; PCB Footprint: RES0402_0-5; Footprint Path: Y:\MIS_DATABASE\Library\ALTIUM_TOOL\PCB_FOOTPRINTS\Altium_Footprint_Lib.PcbLib; Library Path: Y:\MIS_DATABASE\Library\ALTIUM_TOOL\SCHEMATICS_PARTS\MS_DISCRETE_Library.schlib; MECHANICAL 3D STEP FILE: RES0402_0-5; Footprint Ref: RES0402_0-5; Tolerance: 5%; Wattage: 1/16W; Package: 0402; Distributor_name: DIGIKEY; Distributor_part_number: 311-4.7KJRCT-ND; Height: 0.40MM; Weight: 0.65mg; Temperature: -55癈+155癈; Datasheet: Y:\MIS_DATABASE\DATASHEETS\RESISTORS\RCXXXXL-SER_MAR18.PDF; Crtd /date: VASANTHA/130516; Chkd/date: VASANTHA/130516; Library Ref: RESISTOR
R203 = RESISTOR_Dup4: RES 4.7K 1/16W 5% 0402; Part_type: RESISTORS\FIXED; Mfr_part_number: RC0402JR-074K7L; Mfr_name: YAGEO AMERICA; Mistral Part No: 110011060001-R; Custom_Duty: 15%; Customs_HS_Code: 85332119; Voltage: NA; Project: TMDXCSK368; PCB Footprint: RES0402_0-5; Footprint Path: Y:\MIS_DATABASE\Library\ALTIUM_TOOL\PCB_FOOTPRINTS\Altium_Footprint_Lib.PcbLib; Library Path: Y:\MIS_DATABASE\Library\ALTIUM_TOOL\SCHEMATICS_PARTS\MS_DISCRETE_Library.schlib; MECHANICAL 3D STEP FILE: RES0402_0-5; Footprint Ref: RES0402_0-5; Chkd/date: VASANTHA/130516; Crtd /date: VASANTHA/130516; Datasheet: Y:\MIS_DATABASE\DATASHEETS\RESISTORS\RCXXXXL-SER_MAR18.PDF; Temperature: -55癈+155癈; Weight: 0.65mg; Height: 0.40MM; Distributor_part_number: 311-4.7KJRCT-ND; Distributor_name: DIGIKEY; Package: 0402; Wattage: 1/16W; Tolerance: 5%; Library Ref: RESISTOR
R204 = RESISTOR_Dup6: RES 51K 1/16W 5% 0402; Mistral Part No: 110009030966-R; Mfr_name: VISHAY; Mfr_part_number: CRCW040251K0JNED; Part_type: RESISTORS\FIXED; Project: TI_MAXIE_CPB; Voltage: NA; Customs_HS_Code: 85332119; Custom_Duty: 15%; Footprint Path: Y:\MIS_DATABASE\Library\ALTIUM_TOOL\PCB_FOOTPRINTS\Altium_Footprint_Lib.PcbLib; Library Path: Y:\MIS_DATABASE\Library\ALTIUM_TOOL\SCHEMATICS_PARTS\MS_DISCRETE_Library.schlib; Footprint Ref: RES0402_0-5; Tolerance: 5%; Wattage: 1/16W; Package: 0402; Distributor_name: DIGIKEY; Distributor_part_number: 541-51KJCT-ND; Height: 0.40MM; Weight: 0.65mg; Temperature: -55癈+155癈; Datasheet: Y:\MIS_DATABASE\DATASHEETS\RESISTORS\CRCW0603.PDF; Crtd /date: MANIRAJA/230817; Chkd/date: MANIRAJA/230817; MECHANICAL 3D STEP FILE: RES0402_0-5; Library Ref: RESISTOR; PCB Footprint: RES0402_0-5
R205 = RESISTOR_Dup6: RES 4.87K 1/16W 1% 0402; Part_type: RESISTORS\FIXED; Mfr_part_number: RC0402FR-074K87L; Mfr_name: YAGEO AMERICA; Mistral Part No: 110019090012-R; Voltage: NA; Custom_Duty: 15%; Customs_HS_Code: 85332119; Project: TI_AM243x LP EVM; Footprint Path: Y:\MIS_DATABASE\Library\ALTIUM_TOOL\PCB_FOOTPRINTS\Altium_Footprint_Lib.PcbLib; Library Path: Y:\MIS_DATABASE\Library\ALTIUM_TOOL\SCHEMATICS_PARTS\MS_DISCRETE_Library.schlib; Temperature: -55癈+155癈; Weight: 0.65mg; Footprint Ref: RES0402_0-5; Library Ref: RESISTOR; Chkd/date: ALVY/091220; Crtd /date: MANIRAJA/091220; Datasheet: Y:\MIS_DATABASE\DATASHEETS\RESISTORS\RCXXXXL-SER_MAR18.PDF; Height: 0.40MM; Distributor_part_number: YAG3175CT-ND; Distributor_name: DIGIKEY; Package: 0402; Wattage: 1/16W; Tolerance: 1%; PCB Footprint: RES0402_0-5; MECHANICAL 3D STEP FILE: RES0402_0-5
R206-R209 R557-R560 = RESISTOR_Dup5: RES 1K 1/10W 1% 0402; Part_type: RESISTORS\FIXED; Mfr_part_number: ERJ-2RKF1001X; Mfr_name: PANASONIC-ECG; Mistral Part No: 110009030411-R; Custom_Duty: 15%; Customs_HS_Code: 85332119; Voltage: NA; Project: VOCERA; Chkd/date: VASANTHA/281216; Crtd /date: MAZHAR/150506; Datasheet: Y:\MIS_DATABASE\DATASHEETS\RESISTORS\PAN-ERJSER_NOV17.PDF; Temperature: -55癈+155癈; Weight: 0.8mg; Height: 0.40MM; Distributor_part_number: P1.00KLCT-ND; Distributor_name: DIGIKEY; Package: 0402; Wattage: 1/10W; Tolerance: 1%; Library Ref: RESISTOR; Footprint Ref: RES0402_0-5; MECHANICAL 3D STEP FILE: RES0402_0-5; Library Path: Y:\MIS_DATABASE\Library\ALTIUM_TOOL\SCHEMATICS_PARTS\MS_DISCRETE_Library.schlib; Footprint Path: Y:\MIS_DATABASE\Library\ALTIUM_TOOL\PCB_FOOTPRINTS\Altium_Footprint_Lib.PcbLib; PCB Footprint: RES0402_0-5
R462 = RESISTOR_Dup6: RES 220E 1/10W 5% 0402; Mistral Part No: 110009030506-R; Mfr_name: PANASONIC-ECG; Mfr_part_number: ERJ-2GEJ221X; Part_type: RESISTORS\FIXED; Project: RED EYE; Customs_HS_Code: 85332119; Custom_Duty: 15%; Voltage: NA; PCB Footprint: RES0402_0-5; Footprint Ref: RES0402_0-5; Library Ref: RESISTOR; Tolerance: 5%; Wattage: 1/10W; Package: 0402; Distributor_name: DIGIKEY; Distributor_part_number: P220JCT-ND; Height: 0.40MM; Datasheet: Y:\MIS_DATABASE\DATASHEETS\RESISTORS\PAN-ERJSER_NOV17.PDF; Crtd /date: GEETHA/260406; Chkd/date: VASANTHA/291216; Weight: 0.8mg; Temperature: -55癈+155癈; MECHANICAL 3D STEP FILE: RES0402_0-5; Library Path: Y:\MIS_DATABASE\Library\ALTIUM_TOOL\SCHEMATICS_PARTS\MS_DISCRETE_Library.schlib; Footprint Path: Y:\MIS_DATABASE\Library\ALTIUM_TOOL\PCB_FOOTPRINTS\Altium_Footprint_Lib.PcbLib
R466 = RESISTOR_Dup6: RES 180E 1/10W 5% 0402; Mistral Part No: 110009030371-R; Mfr_name: PANASONIC-ECG; Mfr_part_number: ERJ-2GEJ181X; Part_type: RESISTORS\FIXED; Project: RED EYE; Customs_HS_Code: 85332119; Custom_Duty: 15%; Voltage: NA; PCB Footprint: RES0402_0-5; MECHANICAL 3D STEP FILE: RES0402_0-5; Tolerance: 5%; Wattage: 1/10W; Package: 0402; Distributor_name: DIGIKEY; Distributor_part_number: P180JCT-ND; Height: 0.40MM; Datasheet: Y:\MIS_DATABASE\DATASHEETS\RESISTORS\PAN-ERJSER_NOV17.PDF; Crtd /date: GEETHA/280406; Chkd/date: MAZHAR/150709; Library Ref: RESISTOR; Footprint Ref: RES0402_0-5; Weight: 0.8mg; Temperature: -55癈+155癈; Library Path: Y:\MIS_DATABASE\Library\ALTIUM_TOOL\SCHEMATICS_PARTS\MS_DISCRETE_Library.schlib; Footprint Path: Y:\MIS_DATABASE\Library\ALTIUM_TOOL\PCB_FOOTPRINTS\Altium_Footprint_Lib.PcbLib
R467 = RESISTOR_Dup6: RES 100E 1/16W 5% 0402; Mistral Part No: 110014060039-R; Mfr_name: VISHAY; Mfr_part_number: CRCW0402100RJNED; Part_type: RESISTORS\FIXED; Project: TI_MAXIE_CPB; Voltage: NA; Customs_HS_Code: 85332119; Custom_Duty: 15%; PCB Footprint: RES0402_0-5; Footprint Path: Y:\MIS_DATABASE\Library\ALTIUM_TOOL\PCB_FOOTPRINTS\Altium_Footprint_Lib.PcbLib; Library Path: Y:\MIS_DATABASE\Library\ALTIUM_TOOL\SCHEMATICS_PARTS\MS_DISCRETE_Library.schlib; Footprint Ref: RES0402_0-5; Library Ref: RESISTOR; Tolerance: 5%; Wattage: 1/16W; Package: 0402; Distributor_name: DIGIKEY; Distributor_part_number: 541-100JCT-ND; Height: 0.40MM; Weight: 0.65mg; Temperature: -55癈+155癈; Datasheet: Y:\MIS_DATABASE\DATASHEETS\RESISTORS\CRCW0603.PDF; Crtd /date: MANIRAJA/230817; Chkd/date: MANIRAJA/230817; MECHANICAL 3D STEP FILE: RES0402_0-5
R468 = RESISTOR_Dup6: RES 220K 1/16W 1% 0402; Mistral Part No: 110017080025-R; Mfr_name: VISHAY; Mfr_part_number: CRCW0402220KFKED; Part_type: RESISTORS\FIXED; Project: TI_MAXIE_CPB; Voltage: NA; Customs_HS_Code: 85332119; Custom_Duty: 15%; PCB Footprint: RES0402_0-5; Footprint Path: Y:\MIS_DATABASE\Library\ALTIUM_TOOL\PCB_FOOTPRINTS\Altium_Footprint_Lib.PcbLib; Library Path: Y:\MIS_DATABASE\Library\ALTIUM_TOOL\SCHEMATICS_PARTS\MS_DISCRETE_Library.schlib; Footprint Ref: RES0402_0-5; Library Ref: RESISTOR; Tolerance: 1%; Wattage: 1/16W; Package: 0402; Distributor_name: DIGIKEY; Distributor_part_number: 541-220KLCT-ND; Height: 0.40MM; Weight: 0.65mg; Temperature: -55癈+155癈; Datasheet: Y:\MIS_DATABASE\DATASHEETS\RESISTORS\CRCW0603.PDF; Crtd /date: MANIRAJA/230817; Chkd/date: MANIRAJA/230817; MECHANICAL 3D STEP FILE: RES0402_0-5
R469 = RESISTOR_Dup6: RES 330K 1/16W 1% 0402; Mistral Part No: 110017080024-R; Mfr_name: VISHAY; Mfr_part_number: CRCW0402330KFKED; Part_type: RESISTORS\FIXED; Project: TI_MAXIE_CPB; Voltage: NA; Customs_HS_Code: 85332119; Custom_Duty: 15%; PCB Footprint: RES0402_0-5; Footprint Path: Y:\MIS_DATABASE\Library\ALTIUM_TOOL\PCB_FOOTPRINTS\Altium_Footprint_Lib.PcbLib; Library Path: Y:\MIS_DATABASE\Library\ALTIUM_TOOL\SCHEMATICS_PARTS\MS_DISCRETE_Library.schlib; Footprint Ref: RES0402_0-5; Library Ref: RESISTOR; Tolerance: 1%; Wattage: 1/16W; Package: 0402; Distributor_name: DIGIKEY; Distributor_part_number: 541-330KLCT-ND; Height: 0.40MM; Weight: 0.65mg; Temperature: -55癈+155癈; Datasheet: Y:\MIS_DATABASE\DATASHEETS\RESISTORS\CRCW0603.PDF; Crtd /date: MANIRAJA/230817; Chkd/date: MANIRAJA/230817; MECHANICAL 3D STEP FILE: RES0402_0-5
R478 = RESISTOR_Dup5: RES 0E 1/16W JUMPER 0402; Part_type: RESISTORS\FIXED; Mfr_part_number: CRCW04020000Z0ED; Mfr_name: VISHAY; Mistral Part No: 110010080019-R; Custom_Duty: 15%; Customs_HS_Code: 85332119; Voltage: NA; Project: PB_BUGBASE; PCB Footprint: RES0402_0-5; MECHANICAL 3D STEP FILE: RES0402_0-5; Chkd/date: VASANTHA/201216; Crtd /date: MUDDU/190810; Datasheet: Y:\MIS_DATABASE\DATASHEETS\RESISTORS\CRCW0603.PDF; Temperature: -55癈+155癈; Weight: 0.65mg; Height: 0.40MM; Distributor_part_number: 541-0.0JCT-ND; Distributor_name: DIGIKEY; Package: 0402; Wattage: 1/16W; Tolerance: NA; Library Ref: RESISTOR; Footprint Ref: RES0402_0-5; Library Path: Y:\MIS_DATABASE\Library\ALTIUM_TOOL\SCHEMATICS_PARTS\MS_DISCRETE_Library.schlib; Footprint Path: Y:\MIS_DATABASE\Library\ALTIUM_TOOL\PCB_FOOTPRINTS\Altium_Footprint_Lib.PcbLib
R561 = RESISTOR_Dup6: RES 30K 1/16W 5% 0402; Mistral Part No: 110017080023-R; Mfr_name: VISHAY; Mfr_part_number: CRCW040230K0JNED; Part_type: RESISTORS\FIXED; Project: TI_MAXIE_CPB; Voltage: NA; Customs_HS_Code: 85332119; Custom_Duty: 15%; Footprint Path: Y:\MIS_DATABASE\Library\ALTIUM_TOOL\PCB_FOOTPRINTS\Altium_Footprint_Lib.PcbLib; Library Path: Y:\MIS_DATABASE\Library\ALTIUM_TOOL\SCHEMATICS_PARTS\MS_DISCRETE_Library.schlib; Footprint Ref: RES0402_0-5; Tolerance: 5%; Wattage: 1/16W; Package: 0402; Distributor_name: DIGIKEY; Distributor_part_number: 541-30KJCT-ND; Height: 0.40MM; Weight: 0.65mg; Temperature: -55癈+155癈; Datasheet: Y:\MIS_DATABASE\DATASHEETS\RESISTORS\CRCW0603.PDF; Crtd /date: MANIRAJA/230817; Chkd/date: MANIRAJA/230817; MECHANICAL 3D STEP FILE: RES0402_0-5; Library Ref: RESISTOR; PCB Footprint: RES0402_0-5
TP35 TP38 = TESTPOINT: TESTPOINT CIR 20 SMD; Mfr_name: LOCAL; MECHANICAL 3D STEP FILE: NA; Project: BT MODULE_CSRBC04; PCB Footprint: TP20_SMD; Footprint Path: Y:\MIS_DATABASE\Library\ALTIUM_TOOL\PCB_FOOTPRINTS\Altium_Footprint_Lib.PcbLib; Library Path: Y:\MIS_DATABASE\Library\ALTIUM_TOOL\SCHEMATICS_PARTS\MS_DISCRETE_Library.schlib; Datasheet: NA; Temperature: NA; Weight: NA; Wattage: NA; Voltage: NA; Tolerance: NA; Mistral Part No: NA; Mfr_part_number: TP20_SMD; Part_type: TESTPOINT; Package: SMD; Distributor_name: NA; Distributor_part_number: NA; Height: NA; Crtd /date: MAZHAR/171006; Chkd/date: SHREESHAIL/171006; Library Ref: TESTPOINT; Footprint Ref: TP20_SMD; RoHS: NA; Customs_HS_Code: NA; Custom_Duty: NA
TP36 TP37 = TESTPOINT: TESTPOINT CIR 20 SMD; Mfr_name: LOCAL; Mistral Part No: NA; Project: BT MODULE_CSRBC04; PCB Footprint: TP20_SMD; RoHS: NA; Footprint Ref: TP20_SMD; Library Ref: TESTPOINT; Chkd/date: SHREESHAIL/171006; Crtd /date: MAZHAR/171006; Height: NA; Distributor_part_number: NA; Distributor_name: NA; Package: SMD; Part_type: TESTPOINT; Mfr_part_number: TP20_SMD; Tolerance: NA; Voltage: NA; Wattage: NA; Weight: NA; Temperature: NA; Datasheet: NA; MECHANICAL 3D STEP FILE: NA; Library Path: Y:\MIS_DATABASE\Library\ALTIUM_TOOL\SCHEMATICS_PARTS\MS_DISCRETE_Library.schlib; Footprint Path: Y:\MIS_DATABASE\Library\ALTIUM_TOOL\PCB_FOOTPRINTS\Altium_Footprint_Lib.PcbLib; Customs_HS_Code: NA; Custom_Duty: NA
U58 = TPD4E004_SON6: IC 4-CH ESD PROTECTION ARRAY FOR HIGH SPEED DATA INTERFACE SON6; Part_type: ICS\INTERFACE; Mfr_name: TEXAS INSTRUMENTS; Mistral Part No: 141010020012-R; Custom_Duty: 15%; Customs_HS_Code: 85423100; Project: BUG_BASE-II; Tolerance: NA; Chkd/date: MANIRAJA/100320; Crtd /date: MUDDU/010310; Datasheet: Y:\MIS_DATABASE\DATASHEETS\ICS\INTERFACE\TPD4E004-SER.PDF; Temperature: -40癈+85癈; Weight: 3.2mg; Height: 0.60MM; Distributor_part_number: 296-23618-1-ND; Distributor_name: DIGIKEY; Package: SON6; Mfr_part_number: TPD4E004DRYR; Library Ref: TPD4E004_SON6; Footprint Ref: SON6_19-68_40X60_PB_0-6; Voltage: NA; Wattage: NA; MECHANICAL 3D STEP FILE: SON6_19-68_40X60_PB_0-6; Library Path: Y:\MIS_DATABASE\Library\ALTIUM_TOOL\SCHEMATICS_PARTS\MS_MISCINTERFACE_Library.schlib; Footprint Path: Y:\MIS_DATABASE\Library\ALTIUM_TOOL\PCB_FOOTPRINTS\Altium_Footprint_Lib.PcbLib; PCB Footprint: SON6_19-68_40X60_PB_0-6
U59 = TM4C1294NCPDTT3R_TQFP128: IC 32-BIT MICROCONTROLLER WITH 1MB FLASH TQFP128; Part_type: ICS\DIGITAL\MICROCONTROLLER; Mfr_name: TEXAS INSTRUMENTS; Mistral Part No: 141217080002-R; Custom_Duty: 15%; Customs_HS_Code: 85423100; Wattage: NA; Project: TI_MAXIE_CPB; MECHANICAL 3D STEP FILE: TQFP128_15-74_550X550_1-2; Chkd/date: MANIRAJA/220817; Crtd /date: MANIRAJA/220817; Datasheet: Y:\MIS_DATABASE\DATASHEETS\ICS\DIGITAL\MICROCONTROLLER\TM4C1294NCPD.PDF; Temperature: -40癈+105癈; Weight: 503.5mg; Height: 1.20MM; Distributor_part_number: TM4C1294NCPDTT3R-ND; Distributor_name: DIGIKEY; Package: TQF9128; Voltage: NA; Tolerance: NA; Mfr_part_number: TM4C1294NCPDTT3R; Library Ref: TM4C1294NCPDTT3R_TQFP128; PCB Footprint: TQFP128_15-74_550X550_1-2
U61 = TPS79601DRBR_SON8: IC 1A HIGH PSRR RF ADJ LDO LINEAR REGULATOR SON8; Part_type: ICS\POWER\VOLTAGE REGULATOR; Mfr_name: TEXAS INSTRUMENTS; Mistral Part No: 142009080012-R; Custom_Duty: 15%; Customs_HS_Code: 85423100; Project: DIO_TXRX; Tolerance: NA; Footprint Ref: SON8_25-59_130X130_1; Library Ref: TPS79601DRBR_SON8; Chkd/date: MANIRAJA/030518; Crtd /date: MAZHAR/280809; Datasheet: Y:\MIS_DATABASE\DATASHEETS\MISC\REGULATORS\TPS796XX.PDF; Temperature: -40癈+125癈; Weight: 24mg; Height: 1.00MM; Distributor_part_number: 296-23107-1-ND; Distributor_name: DIGIKEY; Package: SON8; Mfr_part_number: TPS79601DRBR; Voltage: NA; Wattage: NA; MECHANICAL 3D STEP FILE: SON8_25-59_130X130_1; Library Path: Y:\MIS_DATABASE\Library\ALTIUM_TOOL\SCHEMATICS_PARTS\MS_MISCPOWER_Library.schlib; Footprint Path: Y:\MIS_DATABASE\Library\ALTIUM_TOOL\PCB_FOOTPRINTS\Altium_Footprint_Lib.PcbLib; PCB Footprint: SON8_25-59_130X130_1
U95 = LM4040B25IDCKR_SC70-5: IC PRECISION MICROPOWER SHUNT VOLTAGE REFERENCE SC70-5; Part_type: ICS\POWER\VOLTAGE REGULATOR; Mfr_name: TEXAS INSTRUMENTS; Mistral Part No: 142017080015-R; Custom_Duty: 15%; Customs_HS_Code: 85423100; Wattage: NA; Project: TI_MAXIE_CPB; PCB Footprint: SC70-5_1-1; MECHANICAL 3D STEP FILE: SC70-5_1-1; Chkd/date: MANIRAJA/230817; Crtd /date: MANIRAJA/230817; Datasheet: Y:\MIS_DATABASE\DATASHEETS\ICS\POWER\LM4040B25I.PDF; Temperature: -40癈+85癈; Weight: 30mg; Height: 1.10MM; Distributor_part_number: 296-20873-1-ND; Distributor_name: DIGIKEY; Package: SC70-5; Voltage: NA; Tolerance: NA; Mfr_part_number: LM4040B25IDCKR; Library Ref: LM4040B25IDCKR_SC70-5
Y2 = CRY4_13: CRY 16.000MHz SMD; Mistral Part No: 130017080024-R; Mfr_name: NDK; Mfr_part_number: NX3225GA-16.000M-STD-CRG-1; Part_type: CRYSTAL; Project: TI_MAXIE_CPB; Tolerance: NA; Customs_HS_Code: 85439000; Custom_Duty: 24%; PCB Footprint: XTAL4_NX3225GA_130X100_SMD_0-9; Voltage: NA; Wattage: NA; Package: SMD; Distributor_name: DIGIKEY; Distributor_part_number: 644-1157-1-ND; Height: 0.90MM; Weight: NA; Temperature: -40癈+85癈; Datasheet: Y:\MIS_DATABASE\DATASHEETS\MISC\CRY_OSC\NX3225GA.PDF; Crtd /date: MANIRAJA/230817; Chkd/date: MANIRAJA/230817; MECHANICAL 3D STEP FILE: XTAL4_NX3225GA_130X100_SMD_0-9; Library Ref: CRY4_13